# Altium schematic sheet [01] - COVER PAGE.SchDoc: COVER PAGE
size A4; Organization: Bjørn Brodtkorb; Address1: Frode Rinnans veg 161; Address2: 7050 Trondheim; DocumentNumber: 6598; Revision: 1.0; SheetNumber: 1; SheetTotal: 1
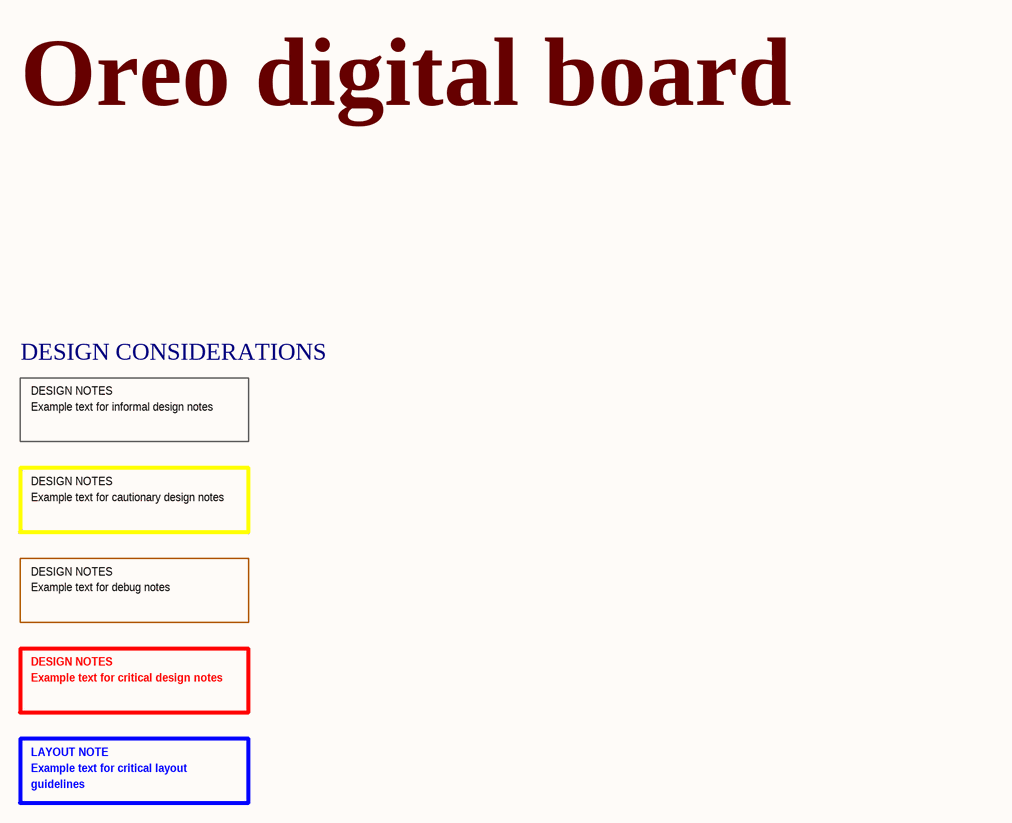
[diagram p0: [01] - COVER PAGE.SchDoc]

## Notes on the sheet
- Oreo digital board
- DESIGN CONSIDERATIONS
- DESIGN NOTES
- Example text for informal design notes
- Example text for cautionary design notes
- Example text for debug notes
- Example text for critical design notes
- LAYOUT NOTE
- Example text for critical layout
- guidelines
- Title
- Size:
- Date:
- A4
- Number:
- Time:
- Revision:
- Sheet
- of
- File: